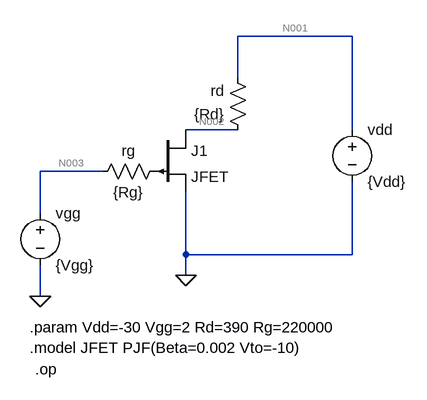
[diagram p0: schematic Q7-2.asc]
Q7-2.asc, the LTspice schematic file:
Version 4
SHEET 1 880 680
WIRE 496 -80 320 -80
WIRE 320 -16 320 -80
WIRE 320 64 240 64
WIRE 496 64 496 -80
WIRE 112 128 16 128
WIRE 16 192 16 128
WIRE 240 256 240 160
WIRE 496 256 496 144
WIRE 496 256 240 256
WIRE 240 288 240 256
WIRE 16 320 16 272
FLAG 16 320 0
FLAG 240 288 0
SYMBOL res 208 112 R90
WINDOW 0 0 56 VBottom 2
WINDOW 3 32 56 VTop 2
SYMATTR InstName rg
SYMATTR Value {Rg}
SYMBOL res 336 80 R180
WINDOW 0 36 76 Left 2
WINDOW 3 36 40 Left 2
SYMATTR InstName rd
SYMATTR Value {Rd}
SYMBOL voltage 16 176 R0
WINDOW 123 0 0 Left 0
WINDOW 39 0 0 Left 0
SYMATTR InstName vgg
SYMATTR Value {Vgg}
SYMBOL voltage 496 48 R0
WINDOW 123 0 0 Left 0
WINDOW 39 0 0 Left 0
SYMATTR InstName vdd
SYMATTR Value {Vdd}
SYMBOL pjf 192 64 R0
SYMATTR InstName J1
SYMATTR Value JFET
TEXT 0 368 Left 2 !.param Vdd=-30 Vgg=2 Rd=390 Rg=220000\n.model JFET PJF(Beta=0.002 Vto=-10)
TEXT 8 432 Left 2 !.op

The netlist it stands for:
* Q7-2.asc
rg P001 N003 {Rg}
rd N002 N001 {Rd}
vgg N003 0 {Vgg}
vdd N001 0 {Vdd}
J1 N002 P001 0 JFET
.model NJF NJF
.model PJF PJF
.lib standard.jft
.param Vdd=-30 Vgg=2 Rd=390 Rg=220000
.model JFET PJF(Beta=0.002 Vto=-10)
.op
.backanno
.end

* Results of the author's LTspice run, read from the files saved beside the schematic
* Operating Point:
*   V(p001) = 2 V
*   V(n003) = 2 V
*   V(n002) = -2.624 V
*   V(n001) = -30 V
*   Id(J1) = -70.2 mA
*   Ig(J1) = 6.644 pA
*   Is(J1) = 70.2 mA
*   I(Rd) = 70.2 mA
*   I(Rg) = -6.644 pA
*   I(Vdd) = 70.2 mA
*   I(Vgg) = -6.644 pA
* From the log:
*   Semiconductor Device Operating Points:
*                           --- JFET Transistors ---
*   Name:      j1
*   Model:    jfet
*   Id:     -7.02e-02
*   Vgs:     2.00e+00
*   Vds:    -2.62e+00
*   Gm:      1.05e-02
*   Gds:     2.15e-02
*   Cgs:     0.00e+00
*   Cgd:     0.00e+00